# EAGLE design ADC (EAGLE 7.6.0)
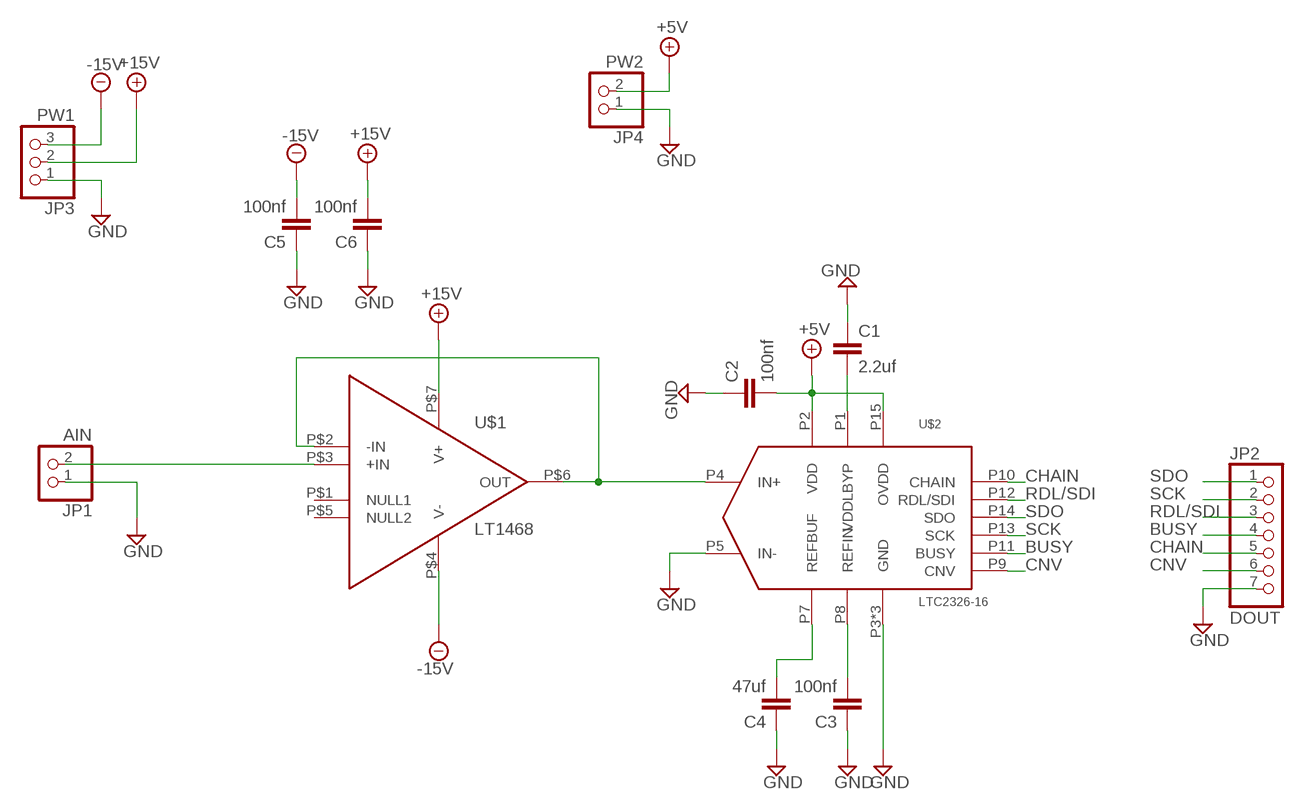
[diagram p0: schematic, sheet 1]

## Parts
C1  2.2uf  C-EUC0603  [C0603]
C2  100nf  C-EUC0603  [C0603]
C3  100nf  C-EUC0603  [C0603]
C4  47uf  C-EUC0603  [C0603]
C5  100nf  C-EUC0603  [C0603]
C6  100nf  C-EUC0603  [C0603]
JP1  AIN  PINHD-1X2  [1X02]
JP2  DOUT  PINHD-1X7  [1X07]
JP3  PW1  PINHD-1X3  [1X03]
JP4  PW2  PINHD-1X2  [1X02]
U$1  LT1468  [SOIC-8]
U$2  LTC2326-16  [16-MSOP]

## Nets
+5V: C2.2 JP4.2 U$2.P2(VDD) U$2.P15(OVDD)
+15V: C6.2 JP3.2 U$1.P$7(V+)
-15V: C5.2 JP3.3 U$1.P$4(V-)
BUSY: JP2.4 U$2.P11(BUSY)
CHAIN: JP2.5 U$2.P10(CHAIN)
CNV: JP2.6 U$2.P9(CNV)
GND: C1.1 C2.1 C3.1 C4.1 C5.1 C6.1 JP1.1 JP2.7 JP3.1 JP4.1 U$2.P3(GND) U$2.P5(IN-) U$2.P6(GND) U$2.P16(GND)
N$1: U$1.P$2(-IN) U$1.P$6(OUT) U$2.P4(IN+)
N$2: C4.2 U$2.P7(REFBUF)
N$3: C3.2 U$2.P8(REFIN)
N$5: C1.2 U$2.P1(VDDLBYP)
N$7: JP1.2 U$1.P$3(+IN)
RDL/SDI: JP2.3 U$2.P12(RDL/SDI)
SCK: JP2.2 U$2.P13(SCK)
SDO: JP2.1 U$2.P14(SDO)
Unconnected: U$1.P$1(NULL1) U$1.P$5(NULL2)

## Library data of the parts
C1-C6 = resistor:C-EU: CAPACITOR, European symbol
JP1 JP4 = pinhead:PINHD-1X2: PIN HEADER
JP2 = pinhead:PINHD-1X7: PIN HEADER
JP3 = pinhead:PINHD-1X3: PIN HEADER
U$1 = LT1468:LT1468
U$2 = LTC2326-16:LTC2326-16

## Board
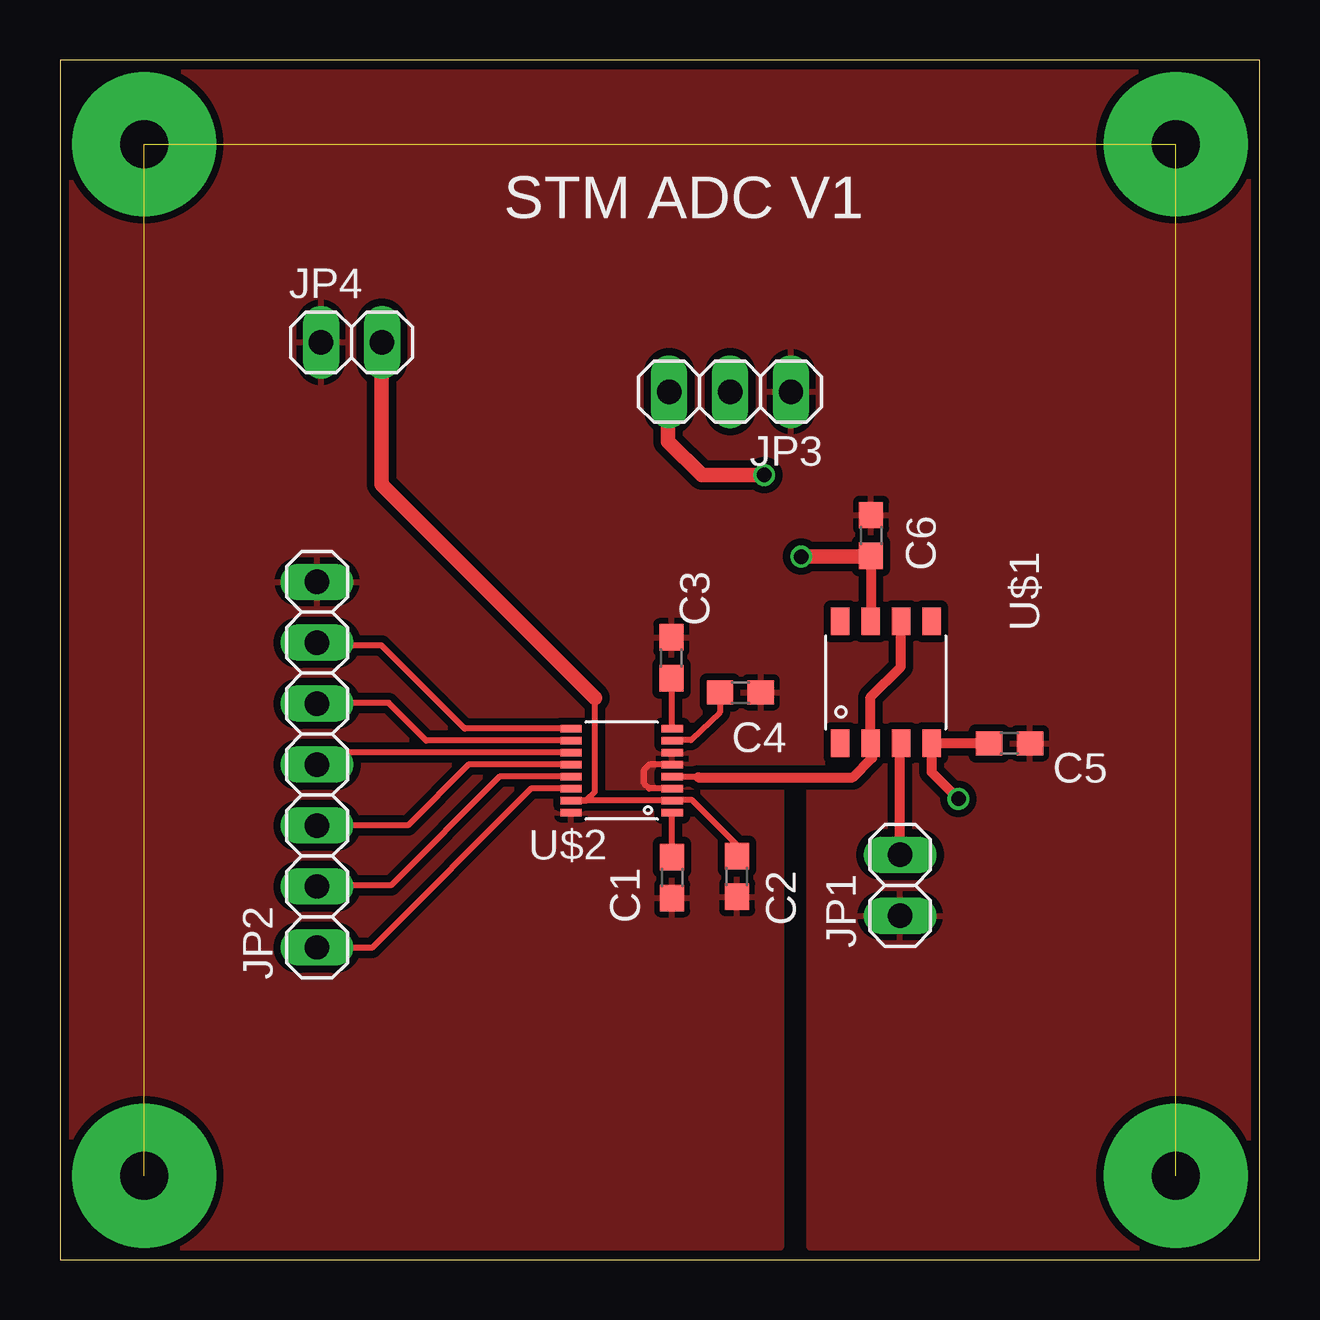
[diagram p1: board, top side]
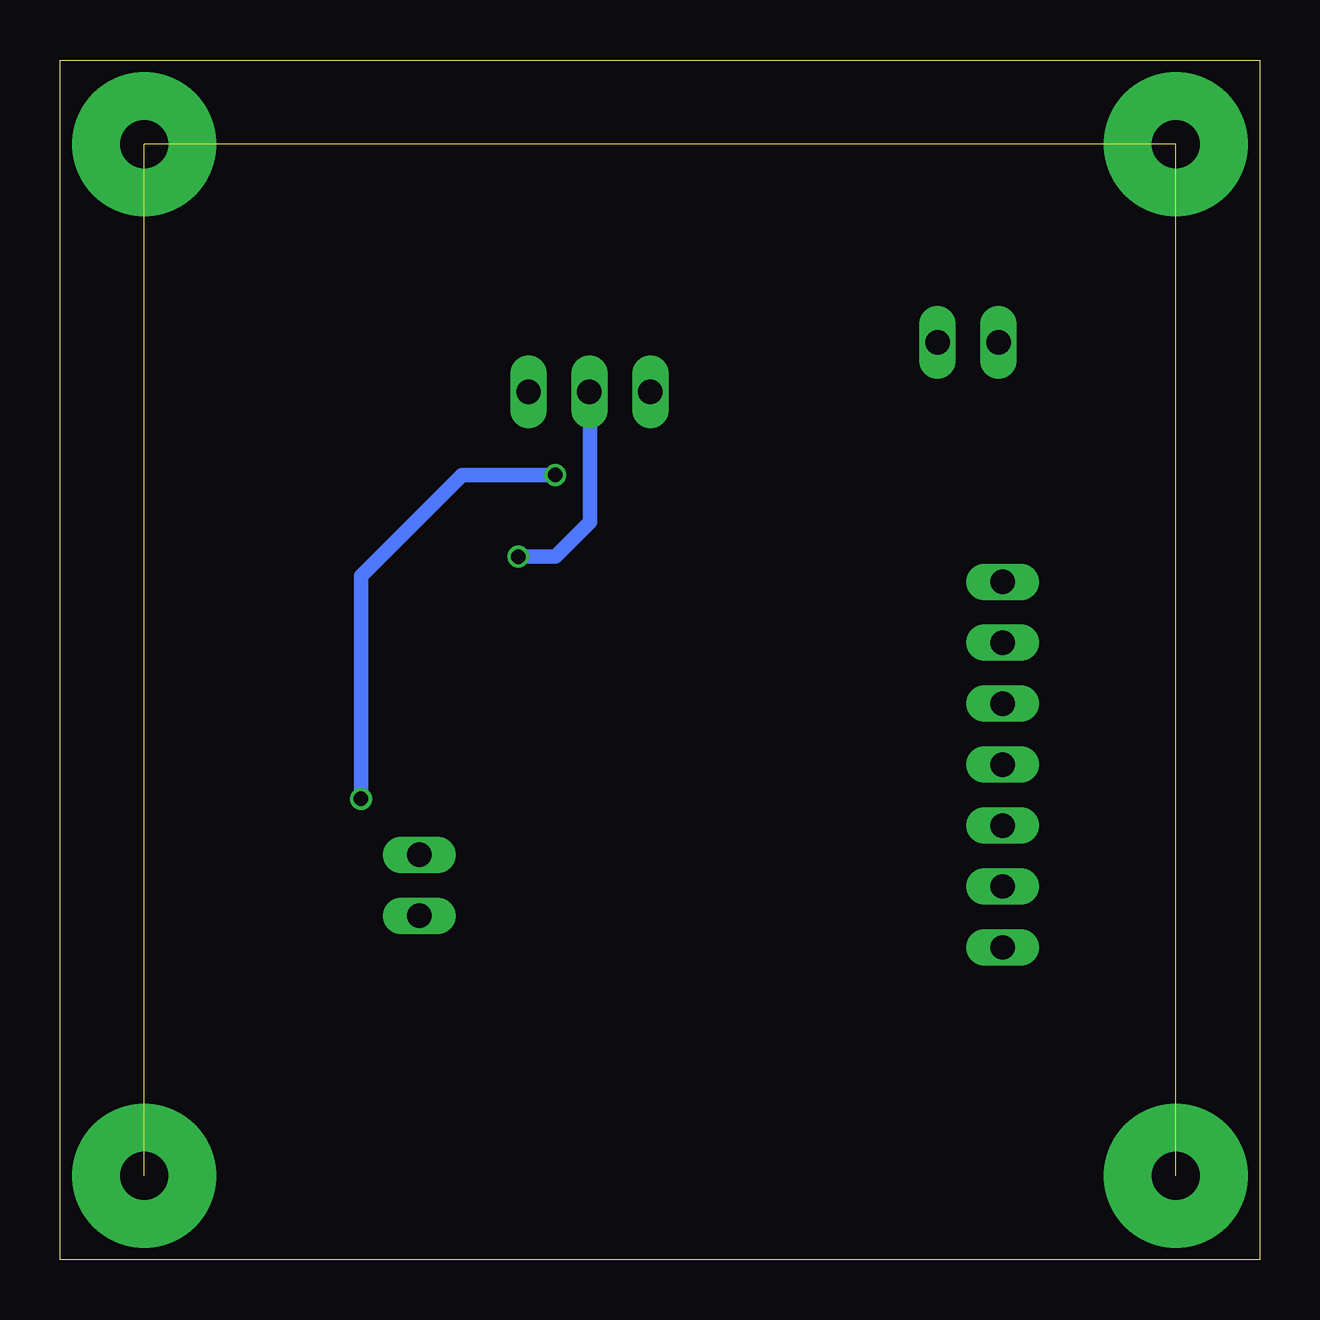
[diagram p2: board, bottom side, seen from below]

Size 50 x 50 mm. Coordinates in mm from the lower left corner, seen from the top.
Outline: 0,0 50,0 50,50 0,50 0,0
Copper layers (1*16): Top 0.035mm / dielectric 1.5mm / Bottom 0.035mm
Design rules "ITead_rule": minimum track width 6mil, minimum drill 12mil, track to track 6mil, track to pad 6mil, pad to pad 6mil, via to via 6mil, smd to smd 0mil, copper to edge 10mil, drill to drill 10mil, minimum pad ring 10mil, minimum via ring 6mil, stop-mask expansion 2mil, vias tented up to drill 100mil, thermal gap 10mil

### Footprints (pad centres in the part's own frame; a part is rotated, then mirrored left to right if it is on the bottom)
C0603 = smd 1.1 x 1: 1 -0.85,0; 2 0.85,0
1X02 = drill 1.016 long: 1 -1.27,0; 2 1.27,0
1X07 = drill 1.016 long: 1 -7.62,0; 2 -5.08,0; 3 -2.54,0; 4 0,0; 5 2.54,0; 6 5.08,0; 7 7.62,0
1X03 = drill 1.016 long: 1 -2.54,0; 2 0,0; 3 2.54,0
SOIC-8 = smd 1.143 x 0.762: P$1 -2.54,1.27; P$2 -2.54,0; P$3 -2.54,-1.27; P$4 -2.54,-2.54; P$5 2.54,-2.54; P$6 2.54,-1.27; P$7 2.54,0; P$8 2.54,1.27
16-MSOP = smd 0.889 x 0.305: P1 -2.108,2.002; P2 -2.108,1.501; P3 -2.108,1.001; P4 -2.108,0.5; P5 -2.108,0; P6 -2.108,-0.5; P7 -2.108,-1.001; P8 -2.108,-1.501; P9 2.108,-1.501; P10 2.108,-1.001; P11 2.108,-0.5; P12 2.108,0; P13 2.108,0.5; P14 2.108,1.001; P15 2.108,1.501; P16 2.108,2.002

### Placement (x,y rotation side)
C1  25.52,15.92 90 top
C2  28.22,15.97 90 top
C3  25.48,25.08 270 top
C4  28.36,23.64 180 top
C5  39.58,21.52 180 top
C6  33.81,30.18 270 top
JP1  35.02,15.6 90 top
JP2  10.71,20.63 90 top
JP3  27.93,36.17 180 top
JP4  12.15,38.23 0 top
U$1  33.79,24.06 90 top
U$2  23.41,20.63 180 top

### Tracks (layer width: path | path; a pad name or v marks a point on that pad's centre or on a via)
+5V
  Top 0.254: C2.2 28.22,17.28 26.35,19.15 25.45,19.15 U$2.P2 U$2.P15 21.93,19.13 22.3,19.5 22.3,23.4 | 13.4,38.21 JP4.2
  Top 0.61: 22.3,23.4 13.4,32.3 13.4,38.21
+15V  (via drill 0.6)
  Top 0.406: C6.2 33.81,26.62 U$1.P$7
  Top 0.61: v30.9,29.3 33.78,29.3 C6.2
  Bottom 0.406: 27.9,36.14 JP3.2
  Bottom 0.61: v30.9,29.3 29.35,29.3 27.9,30.75 27.9,36.14
-15V  (via drill 0.6)
  Top 0.406: C5.2 U$1.P$4 36.33,20.32 v37.45,19.2 | 25.35,36.13 JP3.3
  Top 0.61: v29.35,32.7 26.75,32.7 25.35,34.1 25.35,36.13
  Bottom 0.61: v37.45,19.2 37.45,28.5 33.25,32.7 v29.35,32.7
BUSY
  Top 0.254: U$2.P11 11.21,21.13 JP2.4
CHAIN
  Top 0.254: U$2.P10 15.27,21.63 13.7,23.2 10.74,23.2 JP2.5
CNV
  Top 0.254: U$2.P9 16.87,22.13 13.4,25.6 10.82,25.6 JP2.6
GND
  Top 0.254: U$2.P3 24.57,19.63 24.35,19.85 24.35,20.4 24.6,20.65 25.5,20.65 U$2.P5
  pour Top (isolate 0.305): 0.5,49.5 49.5,49.5 49.5,0.5 31.24,0.5 31.24,19.7 30.05,19.7 30.05,0.5 0.5,0.5
MOUNT  (via drill 2 pad 6)  (3 unrouted)
  other vias: 3.5,46.5 46.5,46.5 46.5,3.5 3.5,3.5
N$1
  Top 0.254: U$2.P4 26.57,20.13 26.6,20.1
  Top 0.406: 26.6,20.1 33.05,20.1 33.85,20.9 33.85,21.46 U$1.P$2 33.79,23.44 35.05,24.7 U$1.P$6
N$2
  Top 0.254: C4.2 27.51,22.81 26.3,21.65 25.5,21.65 U$2.P7
N$3
  Top 0.254: U$2.P8 25.52,24.19 C3.2
N$5
  Top 0.254: C1.2 U$2.P1
N$7
  Top 0.406: JP1.2 35.02,21.48 U$1.P$3
RDL/SDI
  Top 0.254: U$2.P12 17.03,20.63 14.5,18.1 JP2.3
SCK
  Top 0.254: U$2.P13 18.33,20.13 13.8,15.6 10.76,15.6 JP2.2
SDO
  Top 0.254: U$2.P14 19.63,19.63 13,13 JP2.1

### Text on the board
tPlace: STM ADC V1